# Altium schematic sheet robot_control_pcb.SchDoc: Robot Control PCB
size A4; Revision: 0.1; SheetNumber: 1; SheetTotal: 5; DrawnBy: OYSM; ProjectNumber: 1; DocumentSize: A4; PCAName: robot_control_pcb
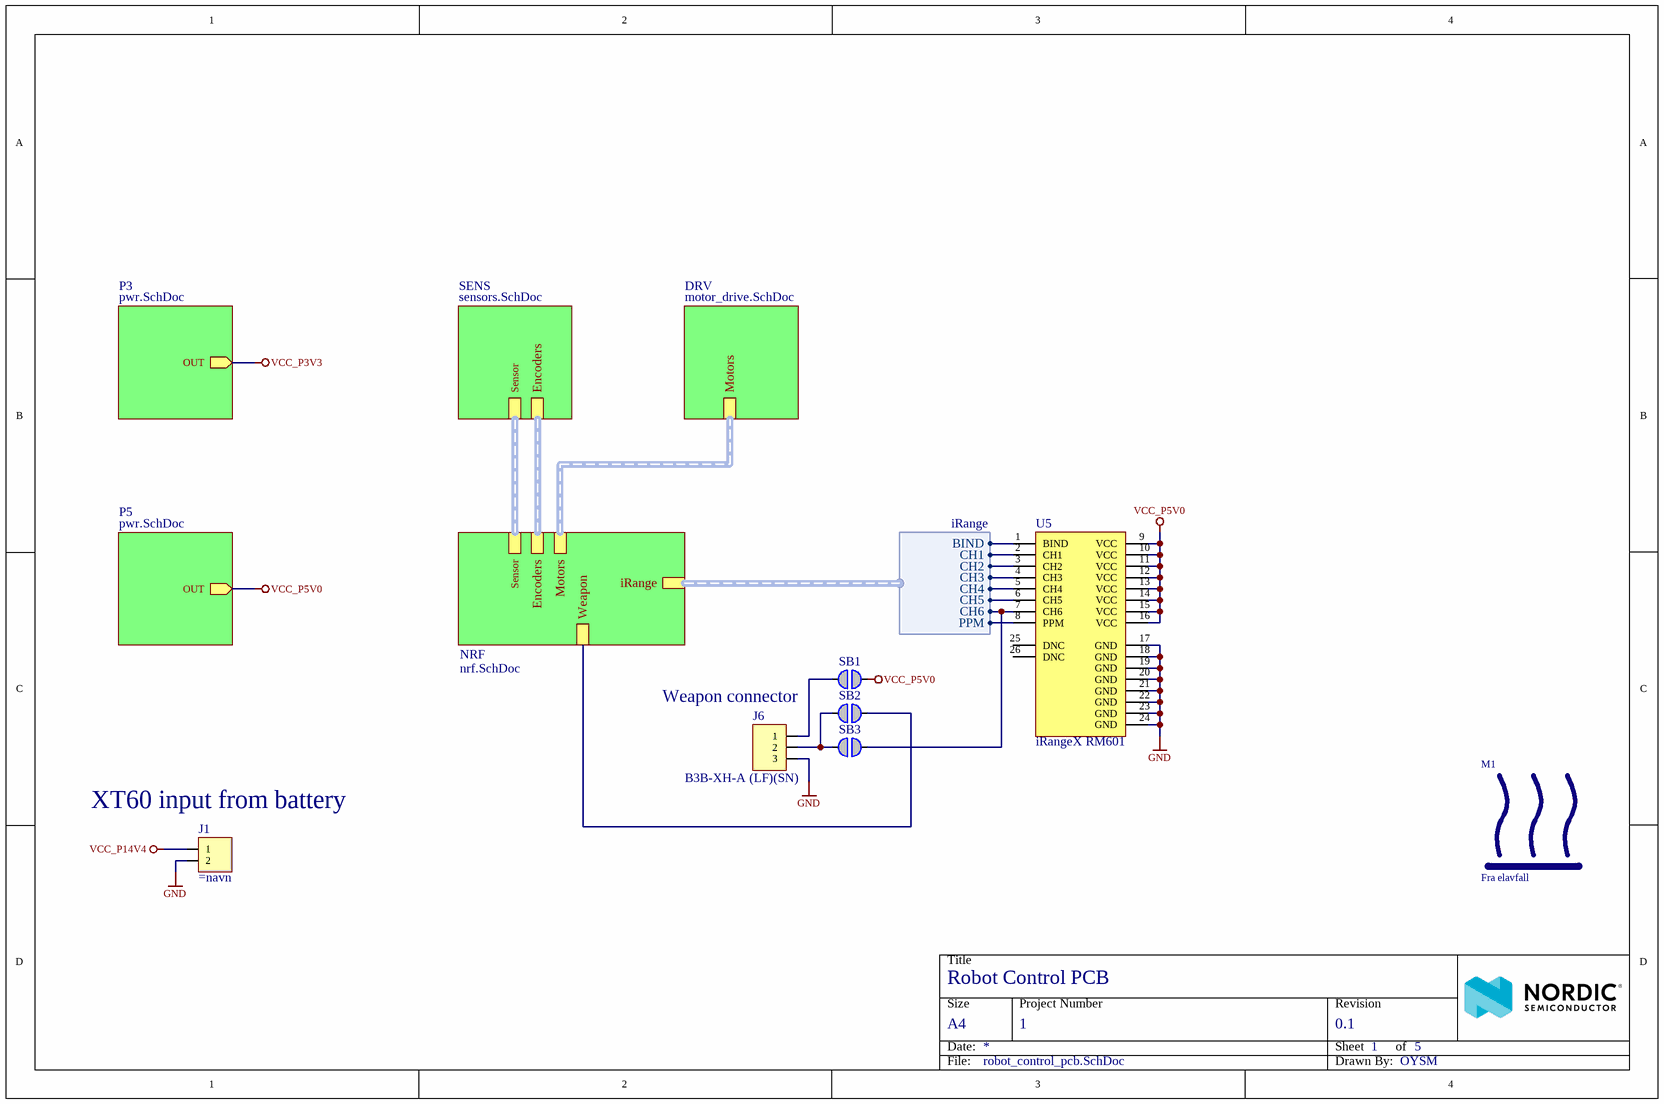
[diagram p0: robot_control_pcb.SchDoc]

## Parts
J1  (no value)  [XT60_Male_Vertical]
J6  B3B-XH-A (LF)(SN)  [JST_3P]
M1  Fra elavfall  [Heatsink_36x31x09]
SB1  Solderbridge  [Solderbridge]  (value not drawn)  (no BOM)
SB2  Solderbridge  [Solderbridge]  (value not drawn)  (no BOM)
SB3  Solderbridge  [Solderbridge]  (value not drawn)  (no BOM)
U5  iRangeX RM601  [iRangeX RM601]

## Sub-sheets
DRV = motor_drive.SchDoc: Motors (harness Motors)
NRF = nrf.SchDoc: Sensor (harness SENSOR), iRange (harness iRange), Encoders (harness Encoders), Motors (harness Motors), Weapon
P3 = pwr.SchDoc: OUT (out)
P5 = pwr.SchDoc: OUT (out)
SENS = sensors.SchDoc: Sensor (harness SENSOR), Encoders (harness Encoders)

## Harnesses
iRange: BIND, CH1, CH2, CH3, CH4, CH5, CH6, PPM

## Nets
GND: J1.2 J6.3 U5.17(GND) U5.18(GND) U5.19(GND) U5.20(GND) U5.21(GND) U5.22(GND) U5.23(GND) U5.24(GND)
VCC_P3V3: sheet P3/OUT
VCC_P5V0: SB1.1 U5.9(VCC) U5.10(VCC) U5.11(VCC) U5.12(VCC) U5.13(VCC) U5.14(VCC) U5.15(VCC) U5.16(VCC) ; sheet P5/OUT
VCC_P14V4: J1.1
NetJ6_1: J6.1 SB1.2
NetJ6_2: J6.2 SB2.2 SB3.2
NetSB2_1: SB2.1 ; sheet NRF/Weapon
NetSB3_1: SB3.1 U5.7(CH6) ; sheet NRF/iRange.CH6
NetU5_1: U5.1(BIND) ; sheet NRF/iRange.BIND
NetU5_2: U5.2(CH1) ; sheet NRF/iRange.CH1
NetU5_3: U5.3(CH2) ; sheet NRF/iRange.CH2
NetU5_4: U5.4(CH3) ; sheet NRF/iRange.CH3
NetU5_5: U5.5(CH4) ; sheet NRF/iRange.CH4
NetU5_6: U5.6(CH5) ; sheet NRF/iRange.CH5
NetU5_8: U5.8(PPM) ; sheet NRF/iRange.PPM

Not connected (* = marked no-connect by the designer): U5 25(DNC) 26(DNC)

## Buses and harness runs
harness sheet DRV/Motors = sheet NRF/Motors
harness sheet NRF/Encoders = sheet SENS/Encoders
harness sheet NRF/Sensor = sheet SENS/Sensor

## Notes on the sheet
- Weapon connector
- (near J1) XT60 input from battery
- Title
- Size
- Date:
- A4
- Project Number
- Sheet         of
- Revision
- File:
- Drawn By:

## Library data of the parts
J1 = 4544: For å koble ledninger sammen; id: 4544
J6 = 4473: JST 3pin (pris pr. stk.); id: 4473; rad: 3; rom: OV; lager_type: Fremlager; dybde: 0; hylle: 6; antall: 100; pakke_opprettet_av: 815; leverandor_varenr: 1516277; pris: 2; nokkelord: Connector, Kontakt; leverandor: Farnell; pakketype: TH; komponenttype: 11; pakke_opprettet: 28.06.2014 18:25:12; symbol_opprettet_av: 815; symbol_opprettet: 28.06.2014 15:33:24; navn: B3B-XH-A (LF)(SN); produsent: JST
M1 = Heatsink
SB1-SB3 = Solderbridge: Artikkelnr Noca: N.A.; Part Number: Solderbridge; Manufacturer: *; Manufacturer Part Number: *; ComponentLink1URL: *; ComponentLink1Description: Datasheet; ComponentLink2URL: *; ComponentLink2Description: Supplier link; HelpURL: *; Footprint Doc: Solderbridge; LatestRevisionDate: 2009-12-14; Pin Count: 2; Publisher: Nordic Semiconductor; Published: 2009-12-14; Value: Solderbridge; Note: *; Supplier 1: *; Supplier Part Number 1: *; Supplier 2: *; Supplier Part Number 2: *; Part number IPS: N.A.